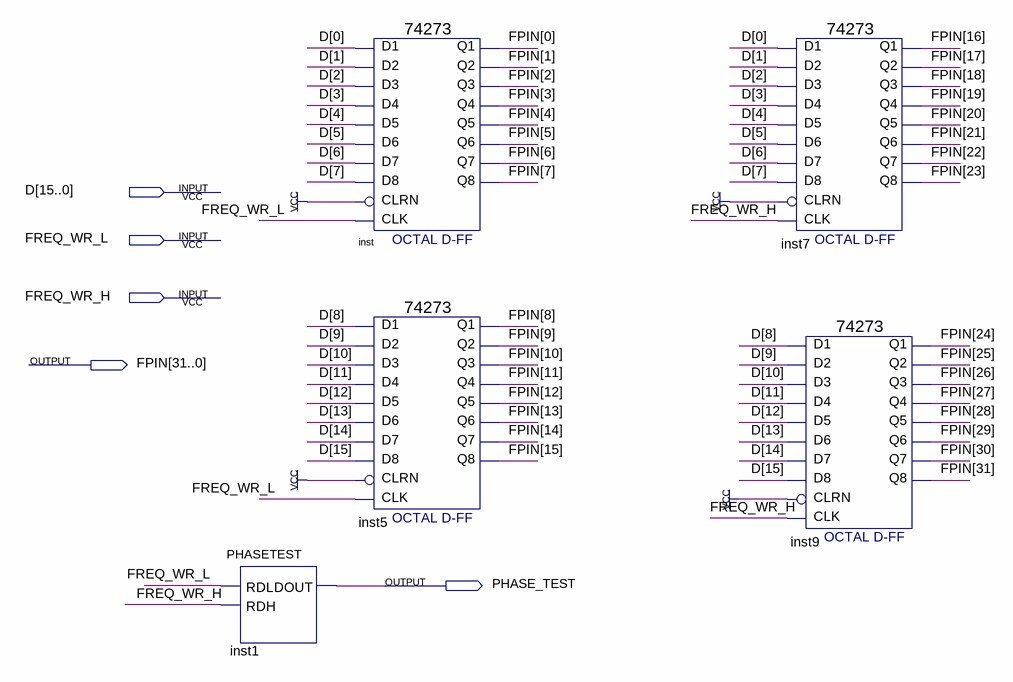
[diagram p0: schematic sheet]
// Quartus schematic FREW.bdf as structural Verilog: 5 symbols, 5 pins
module FREW (
  input  [15:0] D,
  input  FREQ_WR_L,
  input  FREQ_WR_H,
  output [31:0] FPIN,
  output PHASE_TEST
);

  PHASETEST inst1 (.RDL(FREQ_WR_L), .RDH(FREQ_WR_H), .DOUT(PHASE_TEST));
  \74273  inst (
    .D2(D[1]), .D3(D[2]), .D1(D[0]), .D4(D[3]), .D7(D[6]), .D6(D[5]), .D5(D[4]), .D8(D[7]), .CLK(FREQ_WR_L),
    .CLRN(1'b1), .Q4(FPIN[3]), .Q1(FPIN[0]), .Q2(FPIN[1]), .Q3(FPIN[2]), .Q6(FPIN[5]), .Q5(FPIN[4]),
    .Q7(FPIN[6]), .Q8(FPIN[7]));
  \74273  inst5 (
    .D2(D[9]), .D3(D[10]), .D1(D[8]), .D4(D[11]), .D7(D[14]), .D6(D[13]), .D5(D[12]), .D8(D[15]),
    .CLK(FREQ_WR_L), .CLRN(1'b1), .Q4(FPIN[11]), .Q1(FPIN[8]), .Q2(FPIN[9]), .Q3(FPIN[10]), .Q6(FPIN[13]),
    .Q5(FPIN[12]), .Q7(FPIN[14]), .Q8(FPIN[15]));
  \74273  inst7 (
    .D2(D[1]), .D3(D[2]), .D1(D[0]), .D4(D[3]), .D7(D[6]), .D6(D[5]), .D5(D[4]), .D8(D[7]), .CLK(FREQ_WR_H),
    .CLRN(1'b1), .Q4(FPIN[19]), .Q1(FPIN[16]), .Q2(FPIN[17]), .Q3(FPIN[18]), .Q6(FPIN[21]), .Q5(FPIN[20]),
    .Q7(FPIN[22]), .Q8(FPIN[23]));
  \74273  inst9 (
    .D2(D[9]), .D3(D[10]), .D1(D[8]), .D4(D[11]), .D7(D[14]), .D6(D[13]), .D5(D[12]), .D8(D[15]),
    .CLK(FREQ_WR_H), .CLRN(1'b1), .Q4(FPIN[27]), .Q1(FPIN[24]), .Q2(FPIN[25]), .Q3(FPIN[26]), .Q6(FPIN[29]),
    .Q5(FPIN[28]), .Q7(FPIN[30]), .Q8(FPIN[31]));
endmodule
